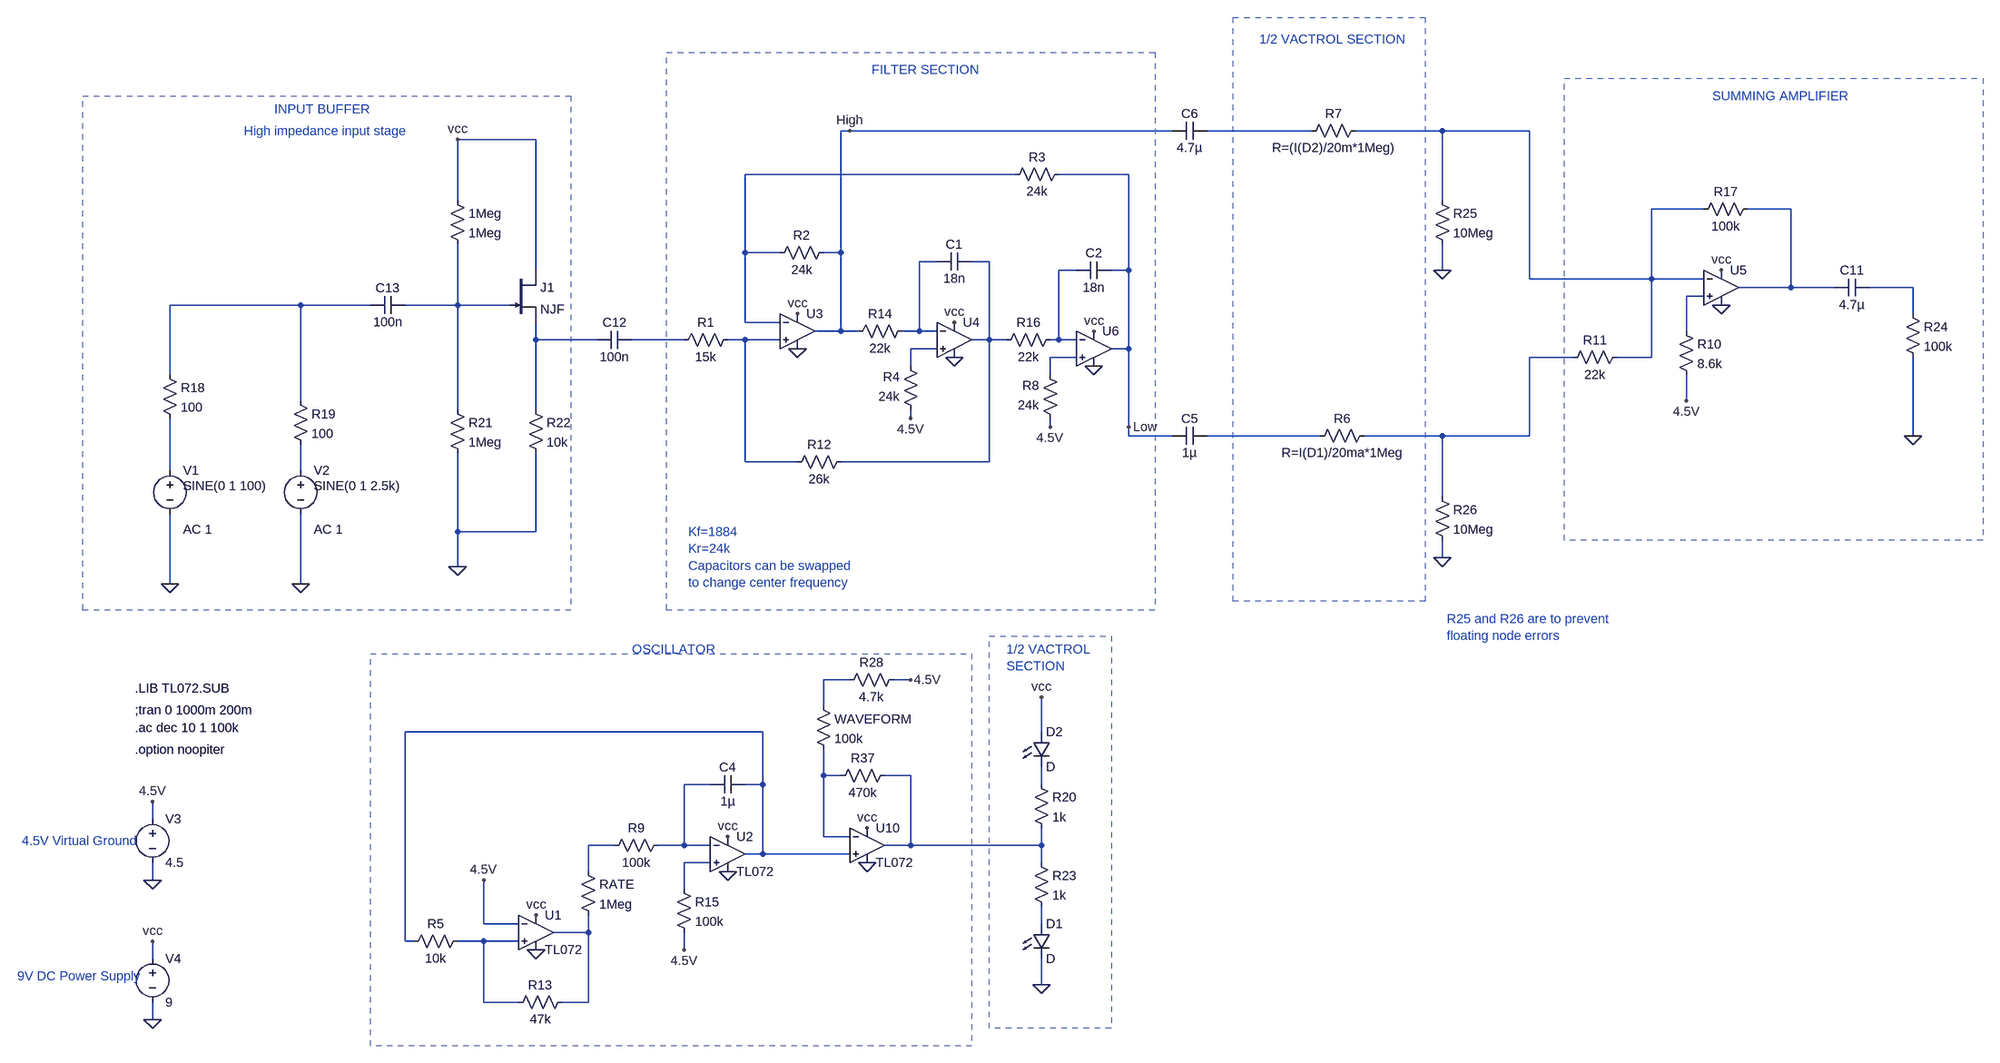
[diagram p0: schematic HarmonicTremolo_V01.asc]
HarmonicTremolo_V01.asc, the LTspice schematic file:
Version 4
SHEET 1 2368 1616
WIRE -64 -128 -80 -128
WIRE 528 -128 -64 -128
WIRE 784 -128 592 -128
WIRE 1024 -128 864 -128
WIRE 1184 -128 1024 -128
WIRE -640 -112 -784 -112
WIRE 240 -48 -256 -48
WIRE 448 -48 320 -48
WIRE -784 0 -784 -112
WIRE 1024 0 1024 -128
WIRE 1504 16 1408 16
WIRE 1664 16 1584 16
WIRE -256 96 -256 -48
WIRE -192 96 -256 96
WIRE -80 96 -80 -128
WIRE -80 96 -112 96
WIRE 96 112 64 112
WIRE 192 112 160 112
WIRE -640 128 -640 -112
WIRE 352 128 320 128
WIRE 448 128 448 -48
WIRE 448 128 416 128
WIRE 1024 128 1024 80
WIRE 1184 144 1184 -128
WIRE 1408 144 1408 16
WIRE 1408 144 1184 144
WIRE 1504 144 1408 144
WIRE 1664 160 1664 16
WIRE 1664 160 1568 160
WIRE 1744 160 1664 160
WIRE 1888 160 1808 160
WIRE 1504 176 1472 176
WIRE -1072 192 -1312 192
WIRE -944 192 -1072 192
WIRE -784 192 -784 80
WIRE -784 192 -880 192
WIRE -688 192 -784 192
WIRE 1888 208 1888 160
WIRE -256 224 -256 96
WIRE -192 224 -256 224
WIRE -80 240 -80 96
WIRE -80 240 -128 240
WIRE -48 240 -80 240
WIRE 64 240 64 112
WIRE 64 240 32 240
WIRE 96 240 64 240
WIRE 1472 240 1472 176
WIRE -640 256 -640 224
WIRE -528 256 -640 256
WIRE -368 256 -464 256
WIRE -256 256 -288 256
WIRE -192 256 -256 256
WIRE 192 256 192 112
WIRE 192 256 160 256
WIRE 224 256 192 256
WIRE 320 256 320 128
WIRE 320 256 304 256
WIRE 352 256 320 256
WIRE 96 272 48 272
WIRE 448 272 448 128
WIRE 448 272 416 272
WIRE 352 288 304 288
WIRE 1264 288 1184 288
WIRE 1408 288 1408 144
WIRE 1408 288 1344 288
WIRE 48 304 48 272
WIRE -1312 320 -1312 192
WIRE 304 320 304 288
WIRE -1072 368 -1072 192
WIRE 1472 368 1472 320
WIRE -784 384 -784 192
WIRE -640 384 -640 256
WIRE 48 400 48 384
WIRE 304 416 304 400
WIRE 448 416 448 272
WIRE 448 432 448 416
WIRE 528 432 448 432
WIRE 800 432 592 432
WIRE 1024 432 880 432
WIRE 1184 432 1184 288
WIRE 1184 432 1024 432
WIRE 1888 432 1888 288
WIRE -256 480 -256 256
WIRE -160 480 -256 480
WIRE 192 480 192 256
WIRE 192 480 -80 480
WIRE -1312 496 -1312 400
WIRE -1072 496 -1072 448
WIRE 1024 544 1024 432
WIRE -784 608 -784 464
WIRE -640 608 -640 464
WIRE -640 608 -784 608
WIRE 1024 656 1024 624
WIRE -784 672 -784 608
WIRE -1312 704 -1312 576
WIRE -1072 704 -1072 576
WIRE -64 880 -112 880
WIRE 48 880 16 880
WIRE -112 928 -112 880
WIRE -224 976 -880 976
WIRE 288 976 288 912
WIRE -112 1056 -112 1008
WIRE -80 1056 -112 1056
WIRE 48 1056 0 1056
WIRE -320 1072 -368 1072
WIRE -224 1072 -224 976
WIRE -224 1072 -256 1072
WIRE 288 1072 288 1040
WIRE -1344 1136 -1344 1104
WIRE -112 1168 -112 1056
WIRE -64 1168 -112 1168
WIRE -496 1184 -544 1184
WIRE -368 1184 -368 1072
WIRE -368 1184 -416 1184
WIRE -320 1184 -368 1184
WIRE 48 1184 48 1056
WIRE 48 1184 0 1184
WIRE 288 1184 288 1152
WIRE 288 1184 48 1184
WIRE -224 1200 -224 1072
WIRE -224 1200 -256 1200
WIRE -64 1200 -224 1200
WIRE -320 1216 -368 1216
WIRE 288 1216 288 1184
WIRE -544 1232 -544 1184
WIRE -1344 1248 -1344 1216
WIRE -368 1264 -368 1216
WIRE -736 1328 -736 1248
WIRE -672 1328 -736 1328
WIRE 288 1328 288 1296
WIRE -544 1344 -544 1312
WIRE -544 1344 -608 1344
WIRE -880 1360 -880 976
WIRE -864 1360 -880 1360
WIRE -736 1360 -784 1360
WIRE -672 1360 -736 1360
WIRE -368 1376 -368 1344
WIRE -1344 1392 -1344 1360
WIRE 288 1440 288 1392
WIRE -736 1472 -736 1360
WIRE -672 1472 -736 1472
WIRE -544 1472 -544 1344
WIRE -544 1472 -592 1472
WIRE -1344 1504 -1344 1472
FLAG -1072 704 0
FLAG -1344 1104 4.5V
FLAG -1344 1248 0
FLAG -1312 704 0
FLAG -1344 1504 0
FLAG -1344 1360 vcc
FLAG 1536 192 0
FLAG 1536 128 vcc
FLAG 1472 368 4.5V
FLAG -784 672 0
FLAG -784 -112 vcc
FLAG 1888 432 0
FLAG 288 912 vcc
FLAG 288 1440 0
FLAG 1024 656 0
FLAG 1024 128 0
FLAG -160 272 0
FLAG -160 208 vcc
FLAG 128 288 0
FLAG 128 224 vcc
FLAG 384 304 0
FLAG 384 240 vcc
FLAG 304 416 4.5V
FLAG 48 400 4.5V
FLAG 448 416 Low
FLAG -64 -128 High
FLAG -640 1376 0
FLAG -288 1232 0
FLAG -640 1312 vcc
FLAG -288 1168 vcc
FLAG -368 1376 4.5V
FLAG -736 1248 4.5V
FLAG -32 1216 0
FLAG -32 1152 vcc
FLAG 48 880 4.5V
SYMBOL voltage -1072 480 R0
WINDOW 123 24 124 Left 2
WINDOW 39 0 0 Left 0
WINDOW 3 24 44 Left 2
SYMATTR Value2 AC 1
SYMATTR Value SINE(0 1 2.5k)
SYMATTR InstName V2
SYMBOL voltage -1344 1120 R0
WINDOW 123 0 0 Left 0
WINDOW 39 0 0 Left 0
SYMATTR InstName V3
SYMATTR Value 4.5
SYMBOL voltage -1312 480 R0
WINDOW 123 24 124 Left 2
WINDOW 39 0 0 Left 0
WINDOW 3 24 44 Left 2
SYMATTR Value2 AC 1
SYMATTR Value SINE(0 1 100)
SYMATTR InstName V1
SYMBOL res -1328 304 R0
SYMATTR InstName R18
SYMATTR Value 100
SYMBOL res -1088 352 R0
SYMATTR InstName R19
SYMATTR Value 100
SYMBOL voltage -1344 1376 R0
WINDOW 123 0 0 Left 0
WINDOW 39 0 0 Left 0
SYMATTR InstName V4
SYMATTR Value 9
SYMBOL OpAmps\\UniversalOpAmp 1536 160 R0
SYMATTR InstName U5
SYMBOL cap 592 416 R90
WINDOW 0 0 32 VBottom 2
WINDOW 3 32 32 VTop 2
SYMATTR InstName C5
SYMATTR Value 1µ
SYMBOL cap 592 -144 R90
WINDOW 0 0 32 VBottom 2
WINDOW 3 32 32 VTop 2
SYMATTR InstName C6
SYMATTR Value 4.7µ
SYMBOL res 1456 224 R0
SYMATTR InstName R10
SYMATTR Value 8.6k
SYMBOL res 1600 0 R90
WINDOW 0 0 56 VBottom 2
WINDOW 3 32 56 VTop 2
SYMATTR InstName R17
SYMATTR Value 100k
SYMBOL njf -688 128 R0
SYMATTR InstName J1
SYMBOL res -800 368 R0
SYMATTR InstName R21
SYMATTR Value 1Meg
SYMBOL res -656 368 R0
SYMATTR InstName R22
SYMATTR Value 10k
SYMBOL res -800 -16 R0
SYMATTR InstName 1Meg
SYMATTR Value 1Meg
SYMBOL cap 1808 144 R90
WINDOW 0 0 32 VBottom 2
WINDOW 3 32 32 VTop 2
SYMATTR InstName C11
SYMATTR Value 4.7µ
SYMBOL res 1872 192 R0
SYMATTR InstName R24
SYMATTR Value 100k
SYMBOL cap -464 240 R90
WINDOW 0 0 32 VBottom 2
WINDOW 3 32 32 VTop 2
SYMATTR InstName C12
SYMATTR Value 100n
SYMBOL cap -880 176 R90
WINDOW 0 0 32 VBottom 2
WINDOW 3 32 32 VTop 2
SYMATTR InstName C13
SYMATTR Value 100n
SYMBOL res 896 416 R90
WINDOW 0 0 56 VBottom 2
WINDOW 3 32 56 VTop 2
SYMATTR InstName R6
SYMATTR Value R=I(D1)/20ma*1Meg
SYMBOL res 880 -144 R90
WINDOW 0 0 56 VBottom 2
WINDOW 3 32 56 VTop 2
SYMATTR InstName R7
SYMATTR Value R=(I(D2)/20m*1Meg)
SYMBOL res 272 1056 R0
SYMATTR InstName R20
SYMATTR Value 1k
SYMBOL res 272 1200 R0
SYMATTR InstName R23
SYMATTR Value 1k
SYMBOL LED 272 1328 R0
SYMATTR InstName D1
SYMBOL LED 272 976 R0
SYMATTR InstName D2
SYMBOL res 1008 -16 R0
SYMATTR InstName R25
SYMATTR Value 10Meg
SYMBOL res 1008 528 R0
SYMATTR InstName R26
SYMATTR Value 10Meg
SYMBOL res -272 240 R90
WINDOW 0 0 56 VBottom 2
WINDOW 3 32 56 VTop 2
SYMATTR InstName R1
SYMATTR Value 15k
SYMBOL OpAmps\\UniversalOpAmp -160 240 R0
SYMATTR InstName U3
SYMBOL OpAmps\\UniversalOpAmp 128 256 R0
SYMATTR InstName U4
SYMBOL OpAmps\\UniversalOpAmp 384 272 R0
SYMATTR InstName U6
SYMBOL res -96 80 R90
WINDOW 0 0 56 VBottom 2
WINDOW 3 32 56 VTop 2
SYMATTR InstName R2
SYMATTR Value 24k
SYMBOL cap 160 96 R90
WINDOW 0 0 32 VBottom 2
WINDOW 3 32 32 VTop 2
SYMATTR InstName C1
SYMATTR Value 18n
SYMBOL cap 416 112 R90
WINDOW 0 0 32 VBottom 2
WINDOW 3 32 32 VTop 2
SYMATTR InstName C2
SYMATTR Value 18n
SYMBOL res 336 -64 R90
WINDOW 0 0 56 VBottom 2
WINDOW 3 32 56 VTop 2
SYMATTR InstName R3
SYMATTR Value 24k
SYMBOL res 64 400 R180
WINDOW 0 36 76 Left 2
WINDOW 3 36 40 Left 2
SYMATTR InstName R4
SYMATTR Value 24k
SYMBOL res 320 416 R180
WINDOW 0 36 76 Left 2
WINDOW 3 36 40 Left 2
SYMATTR InstName R8
SYMATTR Value 24k
SYMBOL res -176 496 R270
WINDOW 0 32 56 VTop 2
WINDOW 3 0 56 VBottom 2
SYMATTR InstName R12
SYMATTR Value 26k
SYMBOL res 48 224 R90
WINDOW 0 0 56 VBottom 2
WINDOW 3 32 56 VTop 2
SYMATTR InstName R14
SYMATTR Value 22k
SYMBOL res 320 240 R90
WINDOW 0 0 56 VBottom 2
WINDOW 3 32 56 VTop 2
SYMATTR InstName R16
SYMATTR Value 22k
SYMBOL res 1360 272 R90
WINDOW 0 0 56 VBottom 2
WINDOW 3 32 56 VTop 2
SYMATTR InstName R11
SYMATTR Value 22k
SYMBOL res -768 1344 R90
WINDOW 0 0 56 VBottom 2
WINDOW 3 32 56 VTop 2
SYMATTR InstName R5
SYMATTR Value 10k
SYMBOL res -400 1168 R90
WINDOW 0 0 56 VBottom 2
WINDOW 3 32 56 VTop 2
SYMATTR InstName R9
SYMATTR Value 100k
SYMBOL res -576 1456 R90
WINDOW 0 0 56 VBottom 2
WINDOW 3 32 56 VTop 2
SYMATTR InstName R13
SYMATTR Value 47k
SYMBOL cap -256 1056 R90
WINDOW 0 0 32 VBottom 2
WINDOW 3 32 32 VTop 2
SYMATTR InstName C4
SYMATTR Value 1µ
SYMBOL res -384 1248 R0
SYMATTR InstName R15
SYMATTR Value 100k
SYMBOL OpAmps\\opamp2 -640 1280 R0
SYMATTR InstName U1
SYMATTR Value TL072
SYMBOL OpAmps\\opamp2 -288 1136 R0
SYMATTR InstName U2
SYMATTR Value TL072
SYMBOL OpAmps\\opamp2 -32 1120 R0
SYMATTR InstName U10
SYMATTR Value TL072
SYMBOL res 16 1040 R90
WINDOW 0 0 56 VBottom 2
WINDOW 3 32 56 VTop 2
SYMATTR InstName R37
SYMATTR Value 470k
SYMBOL res -128 912 R0
SYMATTR InstName WAVEFORM
SYMATTR Value 100k
SYMBOL res 32 864 R90
WINDOW 0 0 56 VBottom 2
WINDOW 3 32 56 VTop 2
SYMATTR InstName R28
SYMATTR Value 4.7k
SYMBOL res -560 1216 R0
SYMATTR InstName RATE
SYMATTR Value 1Meg
TEXT -1376 968 Left 2 !.ac dec 10 1 100k
TEXT -1376 936 Left 2 !;tran 0 1000m 200m
TEXT -1376 896 Left 2 !.LIB TL072.SUB
TEXT -464 824 Left 2 ;OSCILLATOR
TEXT -1120 -168 Left 2 ;INPUT BUFFER
TEXT -24 -240 Left 2 ;FILTER SECTION
TEXT 688 -296 Left 2 ;1/2 VACTROL SECTION
TEXT 1520 -192 Left 2 ;SUMMING AMPLIFIER
TEXT -1584 1176 Left 2 ;4.5V Virtual Ground
TEXT -1592 1424 Left 2 ;9V DC Power Supply
TEXT -1376 1008 Left 2 !.option noopiter
TEXT 224 824 Left 2 ;1/2 VACTROL \nSECTION
TEXT -360 608 Left 2 ;Kf=1884\nKr=24k\nCapacitors can be swapped \nto change center frequency
TEXT -1176 -128 Left 2 ;High impedance input stage
TEXT 1032 768 Left 2 ;R25 and R26 are to prevent \nfloating node errors
RECTANGLE Normal 160 1552 -944 832 2
RECTANGLE Normal -576 752 -1472 -192 2
RECTANGLE Normal 2016 624 1248 -224 2
RECTANGLE Normal 992 736 640 -336 2
RECTANGLE Normal 416 1520 192 800 2
RECTANGLE Normal 496 752 -400 -272 2

The netlist it stands for:
* HarmonicTremolo_V01.asc
V2 N020 0 SINE(0 1 2.5k) AC 1
V3 4.5V 0 4.5
V1 N019 0 SINE(0 1 100) AC 1
R18 N010 N019 100
R19 N010 N020 100
V4 vcc 0 9
XU5 N009 N002 vcc 0 N004 level1 Avol=1Meg GBW=10Meg Vos=0 En=0 Enk=0 In=0 Ink=0 Rin=500Meg  ; pins In+ In- V+ V- OUT
C5 N018 Low 1µ
C6 N001 High 4.7µ
R10 N009 4.5V 8.6k
R17 N004 N002 100k
J1 vcc N011 N012 NJF
R21 N011 0 1Meg
R22 N012 0 10k
R§1Meg vcc N011 1Meg
C11 N008 N004 4.7µ
R24 N008 0 100k
C12 N013 N012 100n
C13 N011 N010 100n
R6 N017 N018 R=I(D1)/20ma*1Meg
R7 N002 N001 R=(I(D2)/20m*1Meg)
R20 N026 N024 1k
R23 N024 N029 1k
D1 N029 0 D
D2 vcc N026 D
R25 N002 0 10Meg
R26 N017 0 10Meg
R1 N014 N013 15k
XU3 N014 N003 vcc 0 High level1 Avol=1Meg GBW=10Meg Vos=0 En=0 Enk=0 In=0 Ink=0 Rin=500Meg  ; pins In+ In- V+ V- OUT
XU4 N015 N005 vcc 0 N006 level1 Avol=1Meg GBW=10Meg Vos=0 En=0 Enk=0 In=0 Ink=0 Rin=500Meg  ; pins In+ In- V+ V- OUT
XU6 N016 N007 vcc 0 Low level1 Avol=1Meg GBW=10Meg Vos=0 En=0 Enk=0 In=0 Ink=0 Rin=500Meg  ; pins In+ In- V+ V- OUT
R2 High N003 24k
C1 N006 N005 18n
C2 Low N007 18n
R3 Low N003 24k
R4 4.5V N015 24k
R8 4.5V N016 24k
R12 N014 N006 26k
R14 N005 High 22k
R16 N007 N006 22k
R11 N002 N017 22k
R5 N031 N022 10k
R9 N025 N027 100k
R13 N030 N031 47k
C4 N022 N025 1µ
R15 N028 4.5V 100k
XU1 N031 4.5V vcc 0 N030 TL072  ; pins In+ In- V+ V- OUT
XU2 N028 N025 vcc 0 N022 TL072  ; pins In+ In- V+ V- OUT
XU10 N022 N023 vcc 0 N024 TL072  ; pins In+ In- V+ V- OUT
R37 N024 N023 470k
R§WAVEFORM N021 N023 100k
R28 4.5V N021 4.7k
RATE N027 N030 1Meg
.model D D
.lib standard.dio
.model NJF NJF
.model PJF PJF
.lib standard.jft
.ac dec 10 1 100k
;tran 0 1000m 200m
.LIB TL072.SUB
* OSCILLATOR
* INPUT BUFFER
* FILTER SECTION
* 1/2 VACTROL SECTION
* SUMMING AMPLIFIER
* 4.5V Virtual Ground
* 9V DC Power Supply
.option noopiter
* 1/2 VACTROL
* SECTION
* Kf=1884
* Kr=24k
* Capacitors can be swapped
* to change center frequency
* High impedance input stage
* R25 and R26 are to prevent
* floating node errors
.lib UniversalOpAmp1.lib
.backanno
.end